# EAGLE schematic TNY-Test (EAGLE 7.6.0)
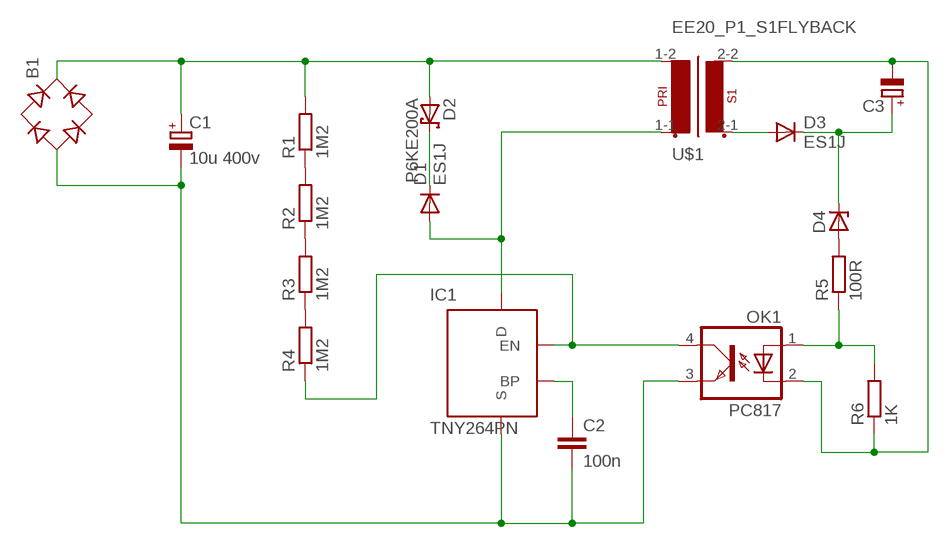
[diagram p0: schematic, sheet 1]

## Parts
B1  RB1A  [RB1A]
C1  10u 400v  CPOL-EUE5-13  [E5-13]
C2  100n  C-EUC0805  [C0805]
C3  CPOL-EUE2.5-7  [E2,5-7]
D1  ES1J  DIODE-DO214AC  [DO214AC]
D2  P6KE200A  P6KEXX  [CB417-15]
D3  ES1J  DIODE-DO214AC  [DO214AC]
D4  ZENER-DIODEDO41Z10  [DO41Z10]
IC1  TNY264PN  [DIP-8B]
OK1  PC817  [DIL04]
R1  1M2  R-EU_R0805  [R0805]
R2  1M2  R-EU_R0805  [R0805]
R3  1M2  R-EU_R0805  [R0805]
R4  1M2  R-EU_R0805  [R0805]
R5  100R  R-EU_R0805  [R0805]
R6  1K  R-EU_R0805  [R0805]
U$1  EE20_P1_S1FLYBACK  [EE20_P1_S1-REV-4PIN]

## Nets
N$1: B1.+ C1.+ D2.A R1.2 U$1.1-2
N$2: B1.- C1.- C2.2 IC1.2(S) IC1.3(S) IC1.7(S) IC1.8(S) OK1.3(EMIT)
N$3: D1.A IC1.5(D) U$1.1-1
N$4: D3.A U$1.2-1(S1-1)
N$5: D1.C D2.C
N$6: C2.1 IC1.1(BP)
N$7: IC1.4(EN) OK1.4(COL) R4.1
N$8: C3.+ D3.C D4.C
N$10: C3.- OK1.2(C) R6.1 U$1.2-2(S1-2)
N$11: R1.1 R2.2
N$12: R2.1 R3.2
N$13: R3.1 R4.2
N$15: D4.A R5.2
N$16: OK1.1(A) R5.1 R6.2
Unconnected: B1.AC1 B1.AC2

## Library data of the parts
B1 = rectifier:RB1A: RECTIFIER 1 A
C1 C3 = rcl:CPOL-EU: POLARIZED CAPACITOR, European symbol
C2 = rcl:C-EU: CAPACITOR, European symbol
D1 D3 = diode:DIODE-: DIODE
D2 = diode:P6KEXX: DIODE transient-voltage suppressor
D4 = diode:ZENER-DIODE: Z-Diode
IC1 = Namenlos:TNY264PN
OK1 = optocoupler:PC817: SHARP OPTO COUPLER; MPN: PC817X4J000F; OC_FARNELL: 9707727; OC_NEWARK: 97K7059
R1-R6 = rcl:R-EU_: RESISTOR, European symbol
U$1 = _Transformers:EE20_P1_S1